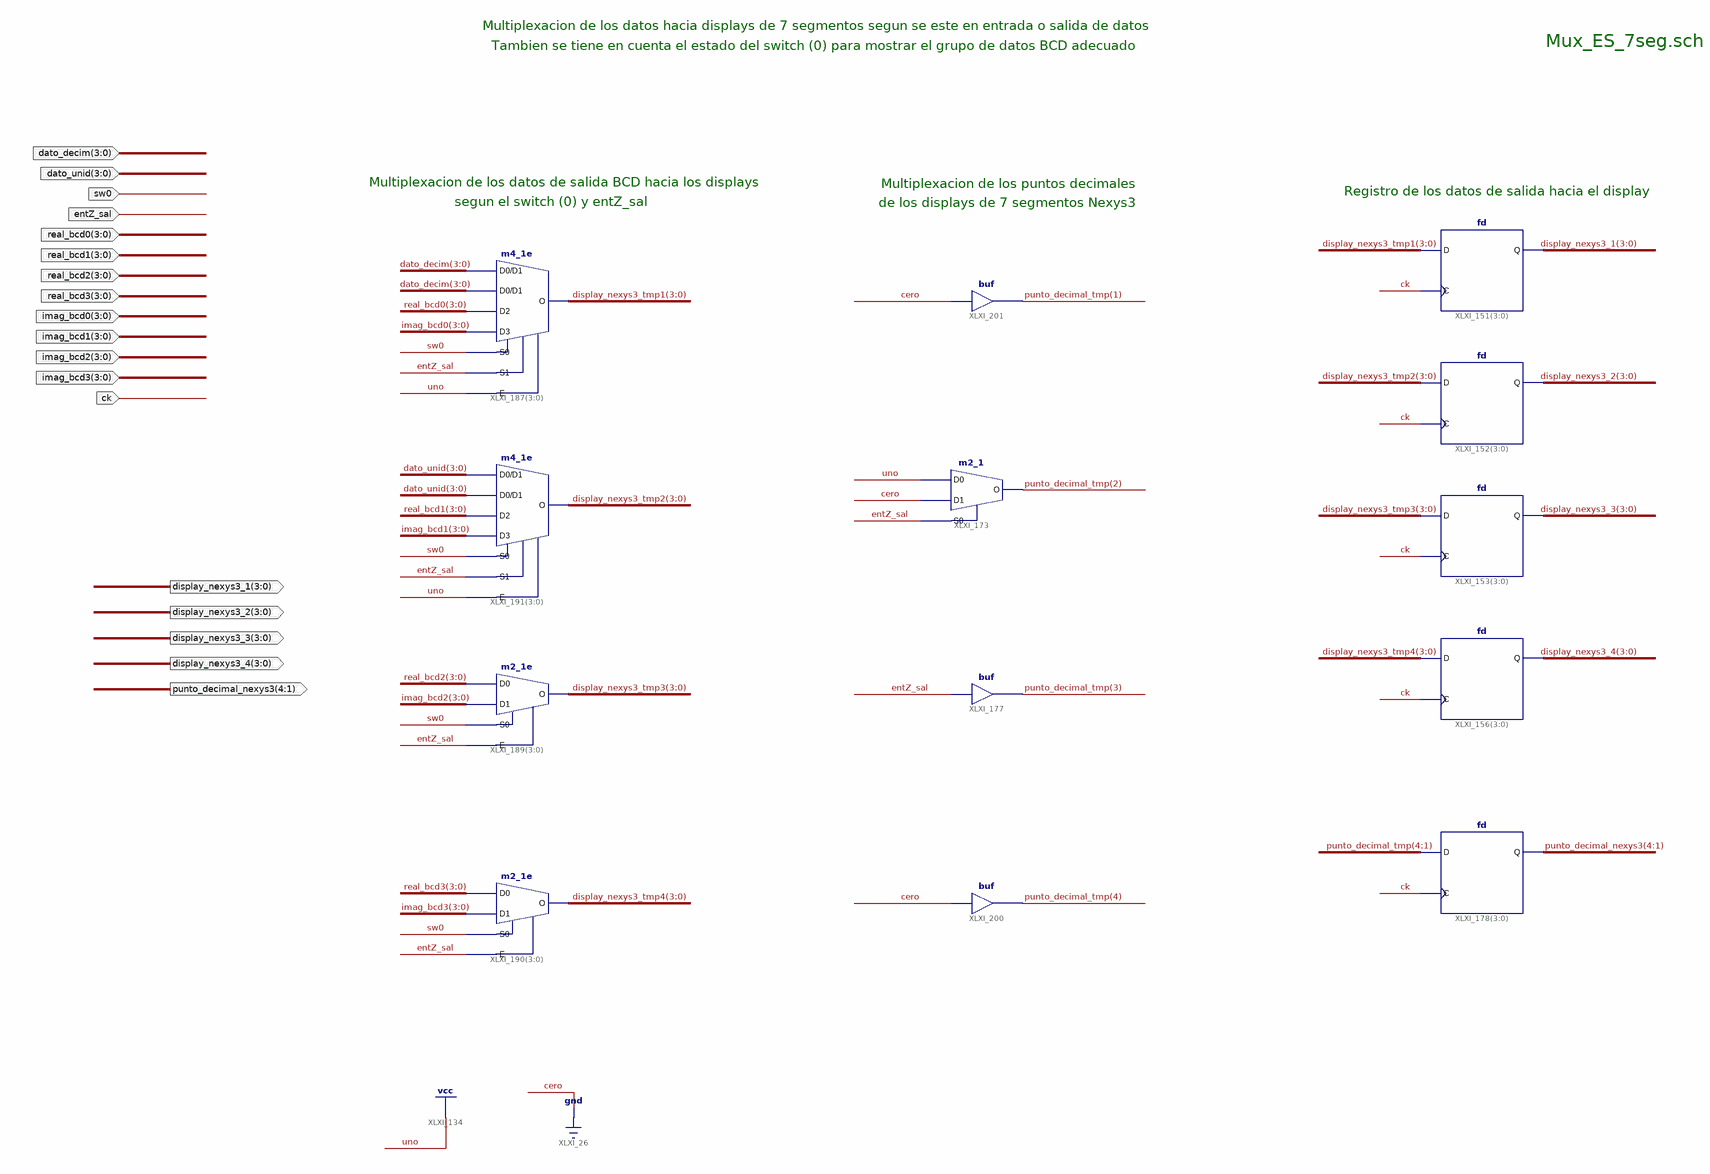
[diagram p0: schematic sheet 1]
// Xilinx ISE schematic mux_ES_7seg.sch (spartan6) as structural Verilog: 13 symbols, 18 ports
module mux_ES_7seg (
  input  entZ_sal,
  input  ck,
  input  [3:0] dato_decim,
  input  [3:0] dato_unid,
  input  [3:0] real_bcd0,
  input  [3:0] real_bcd1,
  input  [3:0] real_bcd2,
  input  [3:0] real_bcd3,
  input  [3:0] imag_bcd0,
  input  [3:0] imag_bcd1,
  input  [3:0] imag_bcd2,
  input  [3:0] imag_bcd3,
  input  sw0,
  output [3:0] display_nexys3_4,
  output [3:0] display_nexys3_2,
  output [3:0] display_nexys3_3,
  output [3:0] display_nexys3_1,
  output [4:1] punto_decimal_nexys3
);

  wire [3:0] display_nexys3_tmp1, display_nexys3_tmp2, display_nexys3_tmp3, display_nexys3_tmp4;
  wire [4:1] punto_decimal_tmp;

  fd XLXI_156[3:0] (.C(ck), .D(display_nexys3_tmp4), .Q(display_nexys3_4));
  fd XLXI_153[3:0] (.C(ck), .D(display_nexys3_tmp3), .Q(display_nexys3_3));
  fd XLXI_152[3:0] (.C(ck), .D(display_nexys3_tmp2), .Q(display_nexys3_2));
  fd XLXI_151[3:0] (.C(ck), .D(display_nexys3_tmp1), .Q(display_nexys3_1));
  fd XLXI_178[3:0] (.C(ck), .D(punto_decimal_tmp), .Q(punto_decimal_nexys3));
  m2_1 XLXI_173 (.D0(1'b1), .D1(1'b0), .S0(entZ_sal), .O(punto_decimal_tmp[2]));
  m2_1e XLXI_189[3:0] (.D0(real_bcd2), .D1(imag_bcd2), .E(entZ_sal), .S0(sw0), .O(display_nexys3_tmp3));
  m2_1e XLXI_190[3:0] (.D0(real_bcd3), .D1(imag_bcd3), .E(entZ_sal), .S0(sw0), .O(display_nexys3_tmp4));
  m4_1e XLXI_191[3:0] (
    .D0(dato_unid), .D1(dato_unid), .D2(real_bcd1), .D3(imag_bcd1), .E(1'b1), .S0(sw0), .S1(entZ_sal),
    .O(display_nexys3_tmp2));
  m4_1e XLXI_187[3:0] (
    .D0(dato_decim), .D1(dato_decim), .D2(real_bcd0), .D3(imag_bcd0), .E(1'b1), .S0(sw0), .S1(entZ_sal),
    .O(display_nexys3_tmp1));
  buf XLXI_177 (punto_decimal_tmp[3], entZ_sal);
  buf XLXI_200 (punto_decimal_tmp[4], 1'b0);
  buf XLXI_201 (punto_decimal_tmp[1], 1'b0);

  // Notes on the sheet:
  //   Multiplexacion de los datos hacia displays de 7 segmentos segun se este en entrada o salida de datos
  //   Mux_ES_7seg.sch
  //   Tambien se tiene en cuenta el estado del switch (0) para mostrar el grupo de datos BCD adecuado
  //   Multiplexacion de los datos de salida BCD hacia los displays
  //   Multiplexacion de los puntos decimales
  //   Registro de los datos de salida hacia el display
  //   segun el switch (0) y entZ_sal
  //   de los displays de 7 segmentos Nexys3
endmodule
